# Altium schematic sheet SCH_2_Battery & Power Management.SchDoc
size A
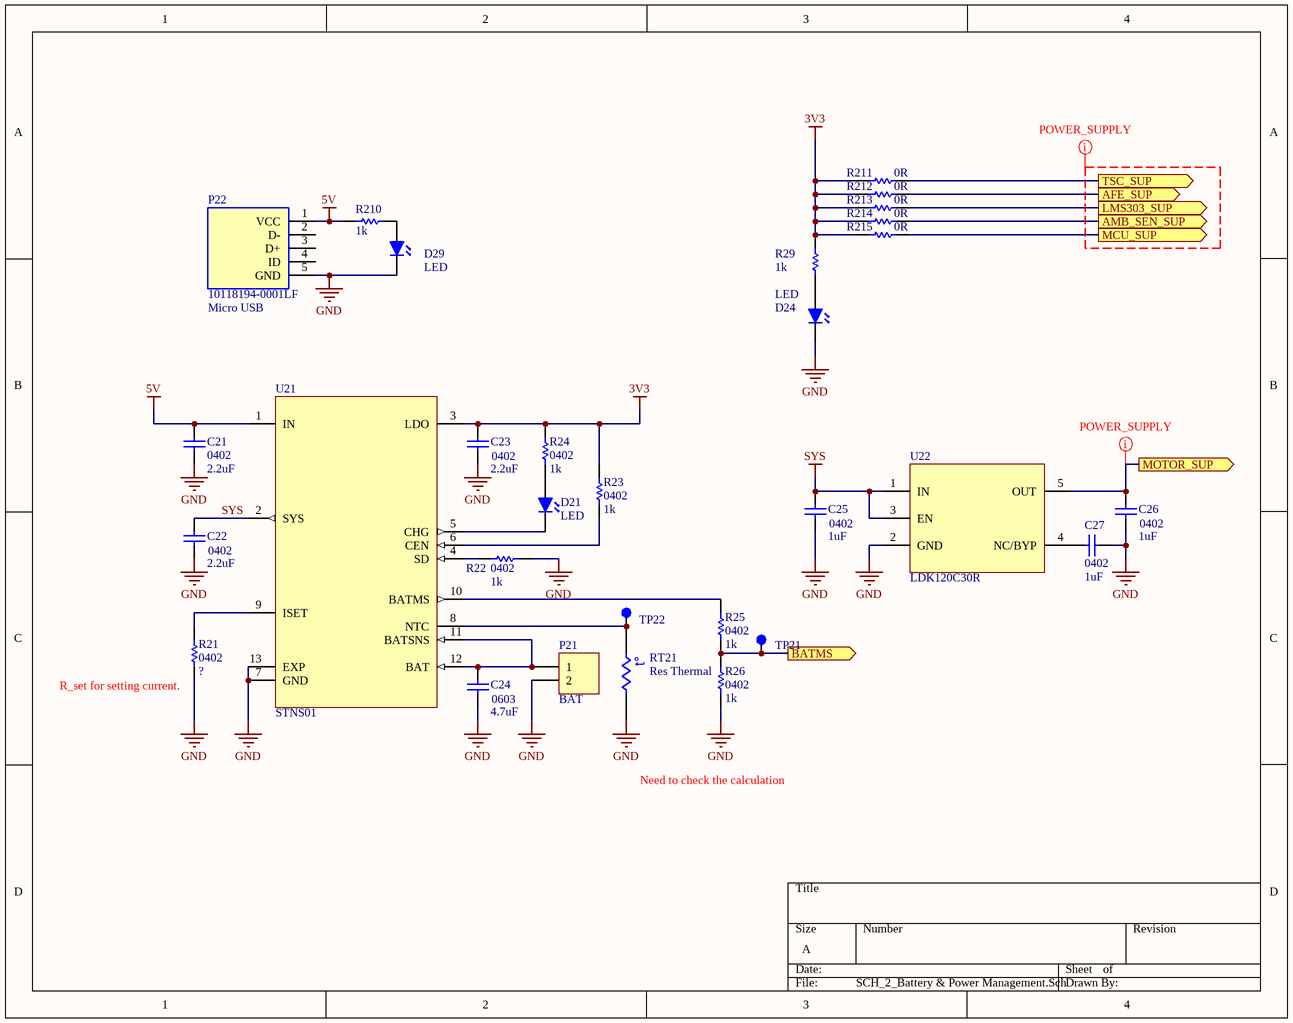
[diagram p0: SCH_2_Battery & Power Management.SchDoc]

## Parts
C21  0402  value 2.2uF  [CAPC1005X07N]
C22  0402  value 2.2uF  [CAPC1005X07N]
C23  0402  value 2.2uF  [CAPC1005X07N]
C24  0603  value 4.7uF  [CAPC1608X10N]
C25  0402  value 1uF  [CAPC1005X07N]
C26  0402  value 1uF  [CAPC1005X07N]
C27  0402  value 1uF  [CAPC1005X07N]
D21  LED  [LED_1005X05N]
D24  LED  [LED_1005X05N]
D29  LED  [LED_1005X05N]
P21  BAT  [HDR1X2]
P22  Micro USB  Manufacture P/N: 10118194-0001LF  [USB_Mirco_Amphenol FCI_10118194]
R21  0402  [RESC1005X04N]
R22  0402  value 1k  [RESC1005X04N]
R23  0402  value 1k  [RESC1005X04N]
R24  0402  value 1k  [RESC1005X04N]
R25  0402  value 1k  [RESC1005X04N]
R26  0402  value 1k  [RESC1005X04N]
R29  value 1k  [RESC1005X04N]  (hidden comment: 0402)
R210  value 1k  [RESC1005X04N]  (hidden comment: 0402)
R211  value 0R  [RESC1005X04N]  (hidden comment: 0402)
R212  value 0R  [RESC1005X04N]  (hidden comment: 0402)
R213  value 0R  [RESC1005X04N]  (hidden comment: 0402)
R214  value 0R  [RESC1005X04N]  (hidden comment: 0402)
R215  value 0R  [RESC1005X04N]  (hidden comment: 0402)
RT21  Res Thermal  [MHDR1X2]
TP21  TP  [TP100]  (value not drawn)
TP22  TP  [TP100]  (value not drawn)
U21  STNS01  [DFN45P300X300X80-12N_HS200X120]
U22  LDK120C30R  [SOT65P210X110-5L]

## Ports
AFE_SUP (out), AMB_SEN_SUP (out), BATMS (out), LMS303_SUP (out), MCU_SUP (out), MOTOR_SUP (out), TSC_SUP (out)

## Nets
3V3: C23.2 R23.1 R24.1 R29.1 R211.1 R212.1 R213.1 R214.1 R215.1 U21.3(LDO)
5V: C21.2 P22.1(VCC) R210.1 U21.1(IN)
GND: C21.1 C22.1 C23.1 C24.1 C25.1 C26.1 C27.1 D24.2(-) D29.2(-) P21.2 P22.5(GND) R21.1 R22.1 R26.2 RT21.2 U21.7(GND) U21.13(EXP) U22.2(GND)
SYS: C22.2 C25.2 U21.2(SYS) U22.1(IN) U22.3(EN)
AFE_SUP: R212.2 ; port AFE_SUP
AMB_SEN_SUP: R214.2 ; port AMB_SEN_SUP
BATMS: R25.2 R26.1 TP21.1 ; port BATMS
LMS303_SUP: R213.2 ; port LMS303_SUP
MCU_SUP: R215.2 ; port MCU_SUP
MOTOR_SUP: C26.2 U22.5(OUT) ; port MOTOR_SUP
TSC_SUP: R211.2 ; port TSC_SUP
NetC24_2: C24.2 P21.1 U21.11(BATSNS) U21.12(BAT)
NetC27_2: C27.2 U22.4(NC/BYP)
NetD21_1: D21.1(+) R24.2
NetD21_2: D21.2(-) U21.5(CHG)
NetD24_1: D24.1(+) R29.2
NetD29_1: D29.1(+) R210.2
NetR21_2: R21.2 U21.9(ISET)
NetR22_2: R22.2 U21.4(SD)
NetR23_2: R23.2 U21.6(CEN)
NetR25_1: R25.1 U21.10(BATMS)
NetRT21_1: RT21.1 TP22.1 U21.8(NTC)

Not connected (* = marked no-connect by the designer): P22 2(D-) 3(D+) 4(ID)

## Layout directives
net class POWER_SUPPLY: (no net found under the mark), MOTOR_SUP

## Notes on the sheet
- (near R21) R_set for setting current.
- Need to check the calculation
- (in symbol Res Thermal) t°

## Library data of the parts
C21-C27 = Cap: Capacitor; Published: 8-Jun-2000; LatestRevisionDate: 17-Jul-2002; LatestRevisionNote: Re-released for DXP Platform.; PackageReference: RAD-0.3; Publisher: Altium Limited; PackageDescription: Radial Cap, Thru-Hole; 2 Leads; 0.3 in Pin Spacing
D21 D24 D29 = LED: General LED
P21 = MHDR1X2: Li-Poly Battery; LatestRevisionDate: 17-Jul-2002; LatestRevisionNote: Re-released for DXP Platform.; Publisher: Altium Limited
P22 = CONN_MICRO_USB: General  Micro USB
R21-R26 R29 R210-R215 = Res1: Resistor; Published: 8-Jun-2000; LatestRevisionDate: 17-Jul-2002; LatestRevisionNote: Re-released for DXP Platform.; PackageReference: AXIAL-0.3; Publisher: Altium Limited; PackageDescription: Axial Device, Thru-Hole; 2 Leads; 0.3 in Pin Spacing
  R21: Value: ?
RT21 = Res Thermal: Thermistor; Published: 24-Mar-1999; LatestRevisionDate: 29-May-2009; LatestRevisionNote: IPC-7351 Footprint Added.; PackageVersion: Mar-2003; PackageReference: 6-0805; Publisher: Altium Limited; PackageDescription: Chip Resistor 0805 Case Size; Code_IPC: RESC2012
TP21 TP22 = TP_A: Test Point dot type
U21 = STNS01: Battery Charger Li-Ion 200mA with LDO 100mA 12-Pin DFN EP T/R
U22 = LDK120C30R: IC REG LDO 3V 0.2A SOT323-5; Manufacturer: STMicroelectronics; Max Input Voltage: 5.5V; Output Current: 200mA; Number of Outputs: 1; Min Input Voltage: 1.9V; Dropout Voltage: 300mV; Operating Supply Current: 50uA; Polarity: Positive; Quiescent Current: 60uA; Accuracy: 2%; Manufacturer Part Number: LDK120C30R; Mount: Surface Mount; Case/Package: SOT-323-5; Number of Pins: 5; Min Operating Temperature: -40°C; Max Operating Temperature: 125°C; Output Voltage: 3V; Packaging: Tape and Reel; Package Quantity: 1; Max Output Current: 200mA; Number of Regulators: 1; Tolerance: 2%; Lead Free: Lead Free; ComponentLink1URL: https://datasheet.ciiva.com/6591/dm00070790-6591173.pdf; ComponentLink1Description: https://datasheet.ciiva.com/6591/dm00070790-6591173.pdf; ComponentLink2URL: https://datasheet.ciiva.com/6591/dm00070790-6591175.pdf; ComponentLink2Description: https://datasheet.ciiva.com/6591/dm00070790-6591175.pdf; ComponentLink3URL: https://datasheet.ciiva.com/6591/dm00070790-6591177.pdf; ComponentLink3Description: https://datasheet.ciiva.com/6591/dm00070790-6591177.pdf; ComponentLink4URL: https://datasheet.ciiva.com/8228/dm00070790-8228636.pdf; ComponentLink4Description: https://datasheet.ciiva.com/8228/dm00070790-8228636.pdf; ComponentLink5URL: https://datasheet.ciiva.com/41439/001184872-da-01-en-ic-reg-ldo-3v-0-ldk120c30r-sot-323-5-stm-41439977.pdf; ComponentLink5Description: https://datasheet.ciiva.com/41439/001184872-da-01-en-ic-reg-ldo-3v-0-ldk120c30r-sot-323-5-stm-41439977.pdf